# Altium schematic sheet Charger .SchDoc
size B; SheetNumber: 1; SheetTotal: 1
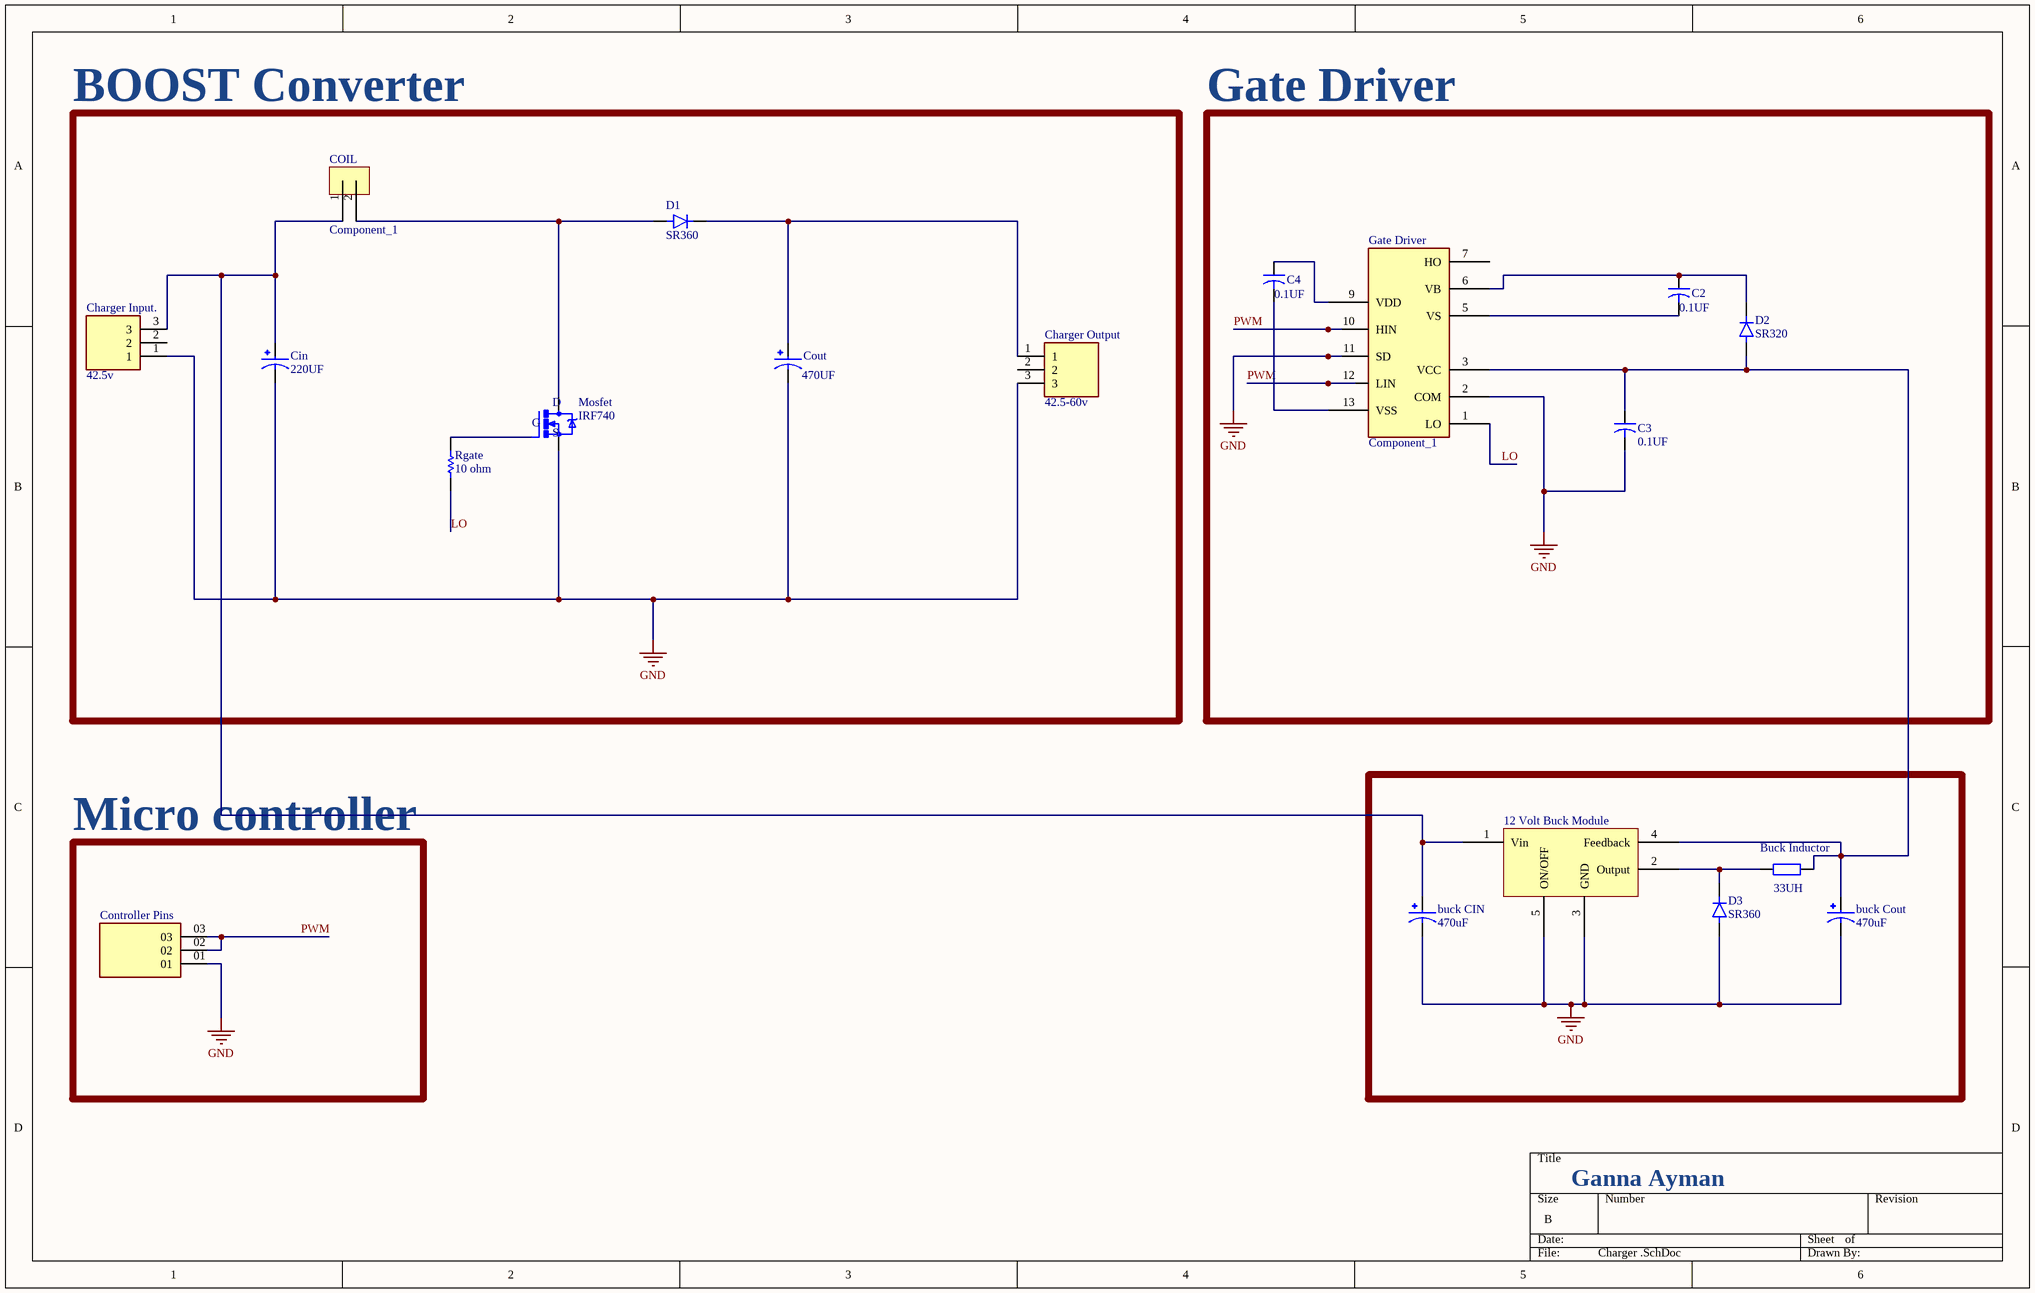
[diagram p0: Charger .SchDoc]

## Parts
12_Volt_Buck_Module  (no value)  [PCBComponent_1]
buck_CIN  470uF  [CAPPRD750W80D1600H2500]
buck_Cout  470uF  [CAPPRD750W80D1600H2500]
Buck_Inductor  value 33UH  [AXIAL-0.4]
C2  0.1UF  [CAPR5-4X5]
C3  0.1UF  [CAPR5-4X5]
C4  0.1UF  [CAPR5-4X5]
Charger_Input.  42.5v  [TE_1977477-3]
Charger_Output  42.5-60v  [TE_1977477-3]
Cin  220UF  [CAPPRD750W80D1600H2500]
COIL  Component_1  [PCBComponent_1]
Controller_Pins  (no value)  [SAMTEC_ESQ-103-59-S-S]
Cout  470UF  [CAPPRD750W80D1600H2500]
D1  SR360  [DIOAD1990W125L900D530]
D2  SR320  [DIOAD1990W125L900D530]
D3  SR360  [DIOAD1990W125L900D530]
Gate_Driver  Component_1  [PCBComponent_1]
Mosfet  IRF740  [TO220BV]
Rgate  value 10 ohm  [R1/4W]  (hidden comment: Res1)

## Blocks framed on the sheet
BOOST Converter: Charger_Input. Charger_Output Cin COIL Cout D1 Mosfet Rgate
Gate Driver: C2-C4 D2 Gate_Driver
Micro controller: Controller_Pins

## Nets
GND: 12_Volt_Buck_Module.3(GND) 12_Volt_Buck_Module.5(ON/OFF) buck_CIN.N buck_Cout.N C3.2 Charger_Input..1 Charger_Output.3 Cin.N Controller_Pins.01 Cout.N D3.A Gate_Driver.2(COM) Gate_Driver.11(SD) Mosfet.S
LO: Gate_Driver.1(LO) Rgate.1
PWM: Controller_Pins.02 Controller_Pins.03 Gate_Driver.10(HIN) Gate_Driver.12(LIN)
Net12_Volt_Buck_Module_1: 12_Volt_Buck_Module.1(Vin) buck_CIN.P Charger_Input..3 Cin.P COIL.1
Net12_Volt_Buck_Module_2: 12_Volt_Buck_Module.2(Output) Buck_Inductor.1 D3.C(K)
Net12_Volt_Buck_Module_4: 12_Volt_Buck_Module.4(Feedback) buck_Cout.P Buck_Inductor.2 C3.1 D2.A Gate_Driver.3(VCC)
NetC2_1: C2.1 D2.C(K) Gate_Driver.6(VB)
NetC2_2: C2.2 Gate_Driver.5(VS)
NetC4_1: C4.1 Gate_Driver.9(VDD)
NetC4_2: C4.2 Gate_Driver.13(VSS)
NetCharger_Output_1: Charger_Output.1 Cout.P D1.C(K)
NetCOIL_2: COIL.2 D1.A Mosfet.D
NetMosfet_G: Mosfet.G Rgate.2

Not connected (* = marked no-connect by the designer): Charger_Input. 2; Charger_Output 2; Gate_Driver 7(HO)

## Notes on the sheet
- Ganna Ayman

## Library data of the parts
12_Volt_Buck_Module = Component_1
buck_CIN buck_Cout Cin Cout = ECA2AM471B: CAP ALUM 470UF 20% 100V RADIAL; MF: Panasonic; Check_prices: https://www.snapeda.com/parts/ECA2AM471B/Panasonic/view-part/?ref=eda; SnapEDA_Link: https://www.snapeda.com/parts/ECA2AM471B/Panasonic/view-part/?ref=snap; Availability: In Stock; Value: *; Price: None; MP: ECA2AM471B; Package: RADIAL-2 Panasonic; Purchase-URL: https://pricing.snapeda.com/search/part/ECA2AM471B/?ref=eda
Buck_Inductor = Res2: Resistor; Published: 8-Jun-2000; LatestRevisionDate: 17-Jul-2002; LatestRevisionNote: Re-released for DXP Platform.; PackageReference: AXIAL-0.4; Publisher: Altium Limited; PackageDescription: Axial Device, Thru-Hole; 2 Leads; 0.4 in Pin Spacing
C2-C4 = Cap2: Capacitor; Published: 23-Sep-2002; PackageReference: CAPR5-4X5; Publisher: Altium Limited; PackageDescription: Capacitor; 2 Leads
  C2 C4: Value: 0.1UF
Charger_Input. Charger_Output = 1977477-3: Conn Barrier Strip 3 POS 8.25mm Solder ST Thru-Hole 15A/Contact Box; MF: TE Connectivity; SnapEDA_Link: https://www.snapeda.com/parts/1977477-3/TE+Connectivity+AMP+Connectors/view-part/?ref=snap; Package: None; Value: *; MP: 1977477-3; Check_prices: https://www.snapeda.com/parts/1977477-3/TE+Connectivity+AMP+Connectors/view-part/?ref=eda
Controller_Pins = ESQ-103-59-S-S: MP: ESQ-103-59-S-S; Availability: Unavailable; Value: *; Package: None; Price: None
D1-D3 = SR320: 3A, 200V, Schottky Rectifier; MF: Taiwan Semiconductor; SnapEDA_Link: https://www.snapeda.com/parts/SR320/Taiwan+Semiconductor/view-part/?ref=snap; Package: DO-201AD Taiwan Semiconductor; Value: *; MP: SR320; Check_prices: https://www.snapeda.com/parts/SR320/Taiwan+Semiconductor/view-part/?ref=eda
Mosfet = IRF740: N-Channel 400 V 10A (Tc) 3.1W (Ta), 125W (Tc) Surface Mount DÂ²PAK (TO-263); MF: Vishay; SnapEDA_Link: https://www.snapeda.com/parts/IRF740/Vishay+Siliconix/view-part/?ref=snap; Package: TO-220-3 Vishay; MP: IRF740; Check_prices: https://www.snapeda.com/parts/IRF740/Vishay+Siliconix/view-part/?ref=eda; Purchase-URL: https://pricing.snapeda.com/search/part/IRF740/?ref=eda; Price: None; Value: *; Availability: In Stock
Rgate = Res1_1: Resistor; Manufacturer: Generic Components; Class: Passive; Published: 08/06/2000; Publisher: Altium Hobart Technology Centre; SubClass: Resistor